# EAGLE design wifi-controller-x4-rev-A (EAGLE 7.3.0)
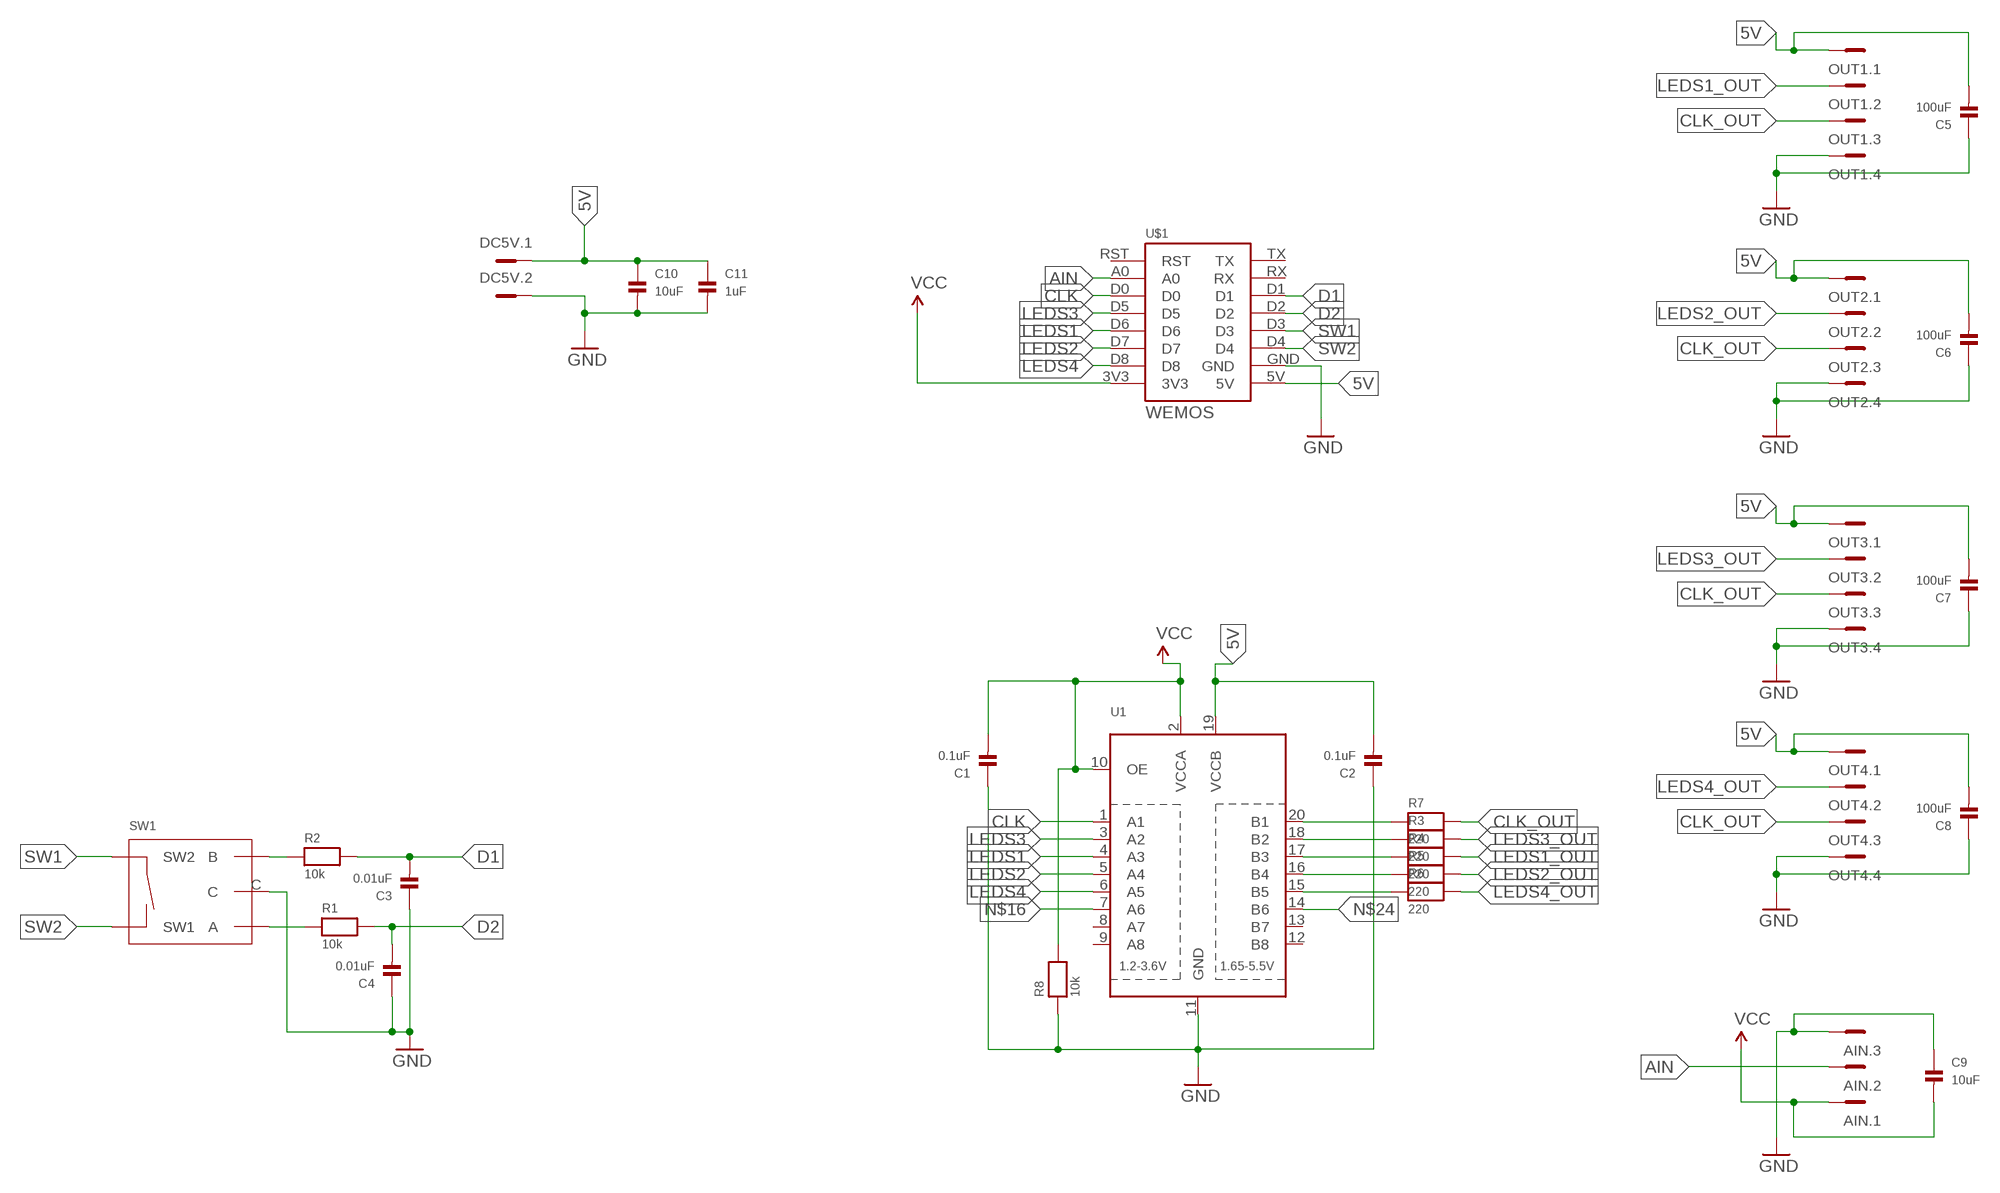
[diagram p0: schematic, sheet 1]

## Parts
AIN  MC3  [MC3]
C1  0.1uF  CAP_CERAMIC0603  [0603]
C2  0.1uF  CAP_CERAMIC0603  [0603]
C3  0.01uF  CAP_CERAMIC0603  [0603]
C4  0.01uF  CAP_CERAMIC0603  [0603]
C5  100uF  CAP_CERAMIC1206  [1206]
C6  100uF  CAP_CERAMIC1206  [1206]
C7  100uF  CAP_CERAMIC1206  [1206]
C8  100uF  CAP_CERAMIC1206  [1206]
C9  10uF  CAP_CERAMIC0603  [0603]
C10  10uF  CAP_CERAMIC0603  [0603]
C11  1uF  CAP_CERAMIC0603  [0603]
DC5V  MC2  [MC2]
OUT1  MC4  [MC4]
OUT2  MC4  [MC4]
OUT3  MC4  [MC4]
OUT4  MC4  [MC4]
R1  10k  RESISTOR0603  [0603]
R2  10k  RESISTOR0603  [0603]
R3  220  RESISTOR0603  [0603]
R4  220  RESISTOR0603  [0603]
R5  220  RESISTOR0603  [0603]
R6  220  RESISTOR0603  [0603]
R7  220  RESISTOR0603  [0603]
R8  10k  RESISTOR0603  [0603]
SW1  ROTARY-ENCODER-BOURNS-PEC11S  [PEC11S]
U1  TXB0108PWR  [TSSOP20]
U$1  WEMOS  [WEMOS]

## Nets
5V: C2.2 C5.2 C6.2 C7.2 C8.2 C10.1 C11.1 DC5V.1 OUT1.1 OUT2.1 OUT3.1 OUT4.1 U1.19(VCCB) U$1.5V
AIN: AIN.2 U$1.A0
CLK: U1.1(A1) U$1.D0
CLK_OUT: OUT1.3 OUT2.3 OUT3.3 OUT4.3 R7.2
D1: C3.2 R2.2 U$1.D1
D2: C4.2 R1.2 U$1.D2
GND: AIN.3 C1.1 C2.1 C3.1 C4.1 C5.1 C6.1 C7.1 C8.1 C9.1 C10.2 C11.2 DC5V.2 OUT1.4 OUT2.4 OUT3.4 OUT4.4 R8.1 SW1.C U1.11(GND) U$1.GND
LEDS1: U1.4(A3) U$1.D6
LEDS1_OUT: OUT1.2 R4.2
LEDS2: U1.5(A4) U$1.D7
LEDS2_OUT: OUT2.2 R5.2
LEDS3: U1.3(A2) U$1.D5
LEDS3_OUT: OUT3.2 R3.2
LEDS4: U1.6(A5) U$1.D8
LEDS4_OUT: OUT4.2 R6.2
N$1: R7.1 U1.20(B1)
N$2: R3.1 U1.18(B2)
N$3: R2.1 SW1.B
N$4: R4.1 U1.17(B3)
N$5: R5.1 U1.16(B4)
N$6: R1.1 SW1.A
N$7: R6.1 U1.15(B5)
N$16: U1.7(A6)
N$24: U1.14(B6)
SW1: SW1.E(SW2) U$1.D3
SW2: SW1.D(SW1) U$1.D4
VCC: AIN.1 C1.2 C9.2 R8.2 U1.2(VCCA) U1.10(OE) U$1.3V3
Unconnected: U1.8(A7) U1.9(A8) U1.12(B8) U1.13(B7) U$1.RST U$1.RX U$1.TX

## Library data of the parts
AIN = con-phoenix-381_l:MC3: Mini-Combicon 3.81mm horizontal 3-polig (ohne Gegenstecker)
C1-C11 = microbuilder:CAP_CERAMIC: Ceramic Capacitors 0402 - 0402 Surface Mount Capacitors 16pF 50V 5% [Digikey: 445-4899-2-ND] 18pF 50V 5% [Digikey: 490-1281-2-ND] 22pF 50V 5% [Digikey: 490-1283-2-ND] 68pF 50V 5% [Digikey: 490-1289-2-ND] 0.1uF 10V 10% [Digikey: 490-1318-2-ND] 1.0uF 6.3V 10% [Digikey: 490-1320-2-ND] 0603 - 0603 Surface Mount Capacitors 16 pF 50V 5% [Digikey: 445-5051-2-ND] 22 pF 50V [Digikey: PCC220ACVTR-ND] 33 pF 50V 5% [Digikey: 490-1415-1-ND] 56pF 50V 5% [Digikey: 490-1421-1-ND] 220pF 50V 5% [Digikey: 445-1285-1-ND] 680 pF 50V 2200 pF 50V 5% C0G [Digikey: 445-1297-1-ND] 5600 pF 100V 5% X7R [Digikey: 478-3711-1-ND] 0.1 µF 25V 10% [Digikey: PCC2277TR-ND] 0.22 µF 16V 10% X7R [Digikey: 445-1318-1-ND] 1.0 µF 25V 10% [Digikey: 445-5146-2-ND] 0603 - RF Specific 3pF 250V +/-0.1pF RF [Digikey: 712-1347-1-ND] 18 pF 250V 5% [Digikey: 478-3505-1-ND or 712-1322-1-ND] 56 pF 250V 5% C0G RF [Digikey: 490-4867-1-ND] 68 pF 250V RF [Digikey: 490-4868-1-ND] 0805 - 0805 Surface Mount Capacitors 220 pF 250V 2% RF Ceramic Capacitor [Digikey: 712-1398-1-ND] 1000 pF 50V 2% NP0 Ceramic Capacitor [Digikey: 478-3760-1-ND] 0.1 µF 25V 10% Ceramic Capacitor [Digikey: PCC1828TR-ND] 1.0 µF 16V 10% Ceramic Capacitor[Digikey: 490-1691-2-ND] 10.0 µF 10V 10% Ceramic Capacitor[Digikey: 709-1228-1-ND] 10.0 uF 16V 10% Ceramic Capacitor [Digikey: 478-5165-2-ND] 47 uF 6.3V 20% Ceramic Capacitor [Digikey: 587-1779-1-ND or 399-5506-1-ND] 1206 - 1206 Surface Mount Capacitors 47uF 10V 20% Ceramic Capacitor [Digikey: 490-5528-1-ND or 399-5508-1-ND or 445-6010-1-ND] 100uF 6.3V -20%, +80% Y5V Ceramic Capacitor (Digikey: 490-4512-1-ND, Mouser: 81-GRM31CF50J107ZE1L)
DC5V = con-phoenix-381_l:MC2: Mini-Combicon 3.81mm horizontal 2-polig (ohne Gegenstecker)
OUT1-OUT4 = con-phoenix-381_l:MC4: Mini-Combicon 3.81mm horizontal 4-polig (ohne Gegenstecker)
R1-R8 = microbuilder:RESISTOR: Resistors 0402 - 0402 Surface Mount Package 22 Ohm 1% 1/16W [Digikey: 311-22.0LRTR-ND] 33 Ohm 5% 1/16W 1.0K 5% 1/16W 1.5K 5% 1/16W 2.0K 1% 1/16W 10.0K 1% 1/16W [Digikey: 311-10.0KLRTR-ND] 10.0K 5% 1/16W [Digikey: RMCF0402JT10K0TR-ND] 12.1K 1% 1/16W [Digikey: 311-22.0LRTR-ND] 100.0K 5% 1/16W 0603 - 0603 Surface Mount Package 0 Ohm 1/10 Watt 1% Resistor 15 Ohm 1/10 Watt 1% Resistor 33 Ohm 1/10 Watt 1% Resistor 49.9 Ohm 1/10 Watt 1% Resistor 100 Ohm 1/10 Watt 1% Resistor 150 Ohm 1/10 Watt 1% Resistor 240 Ohm 1/10 Watt 1% Resistor 390 Ohm 1/10 Watt 1% Resistor 560 Ohm 1/10 Watt 1% Resistor 680 Ohm 1/10 Watt 1% Resistor 750 Ohm 1/10 Watt 1% Resistor 1.0K Ohm 1/10 Watt 1% Resistor 1.5K Ohm 1/10 Watt 1% Resistor 2.0K Ohm 1/10 Watt 1% Resistor 2.2K Ohm 1/10 Watt 1% Resistor 3.3K Ohm 1/10 Watt 1% Resistor 4.7K Ohm 1/10 Watt 1% Resistor 10.0K Ohm 1/10 Watt 1% Resistor 12.0K Ohm 1/10 Watt 1% Resistor 12.1K Ohm 1/10 Watt 1% Resistor 20.0K Ohm 1/10 Watt 1% Resistor 33.0K Ohm 1/10 Watt 1% Resistor 100.0K Ohm 1/10 Watt 1% Resistor 0805 - 0805 Surface Mount Package 0 Ohm 1/8 Watt 1% Resistor 33 Ohm 1/8 Watt 1% Resistor 100 Ohm 1/8 Watt 1% Resistor 150 Ohm 1/8 Watt 1% Resistor 200 Ohm 1/8 Watt 1% Resistor 240 Ohm 1/8 Watt 1% Resistor 330 Ohm 1/8 Watt 1% Resistor 390 Ohm 1/8 Watt 1% Resistor 470 Ohm 1/8 Watt 1% Resistor 1.0K Ohm 1/8 Watt 1% Resistor 1.5K Ohm 1/8 Watt 1% Resistor 2.0K Ohm 1/8 Watt 1% Resistor 4.7K Ohm 1/8 Watt 1% Resistor 5.1K Ohm 1/8 Watt 1% Resistor 5.6K Ohm 1/8 Watt 1% Resistor 10.0K Ohm 1/8 Watt 1% Resistor 22.0K Ohm 1/8 Watt 1% Resistor 33.0K Ohm 1/8 Watt 1% Resistor 100K Ohm 1/8 Watt 1% Resistor 1206 - 1206 Surface Mount Package 2012 - 2010 Surface Mount Package 0.11 Ohm 1/2 Watt 1% Resistor - Digikey: RHM.11UCT-ND
SW1 = Custom:ROTARY-ENCODER-BOURNS
U1 = microbuilder:TXB0108PWR: 8-Bit Bi-Directional Level Shifter 1.2V-3.6V (VCCA) to 1.65V-5.5V (VCCB) bi-directional level shifter with auto direction sensing. Max data rate - VCCA 1.8V: 20Mbps (50ns), VCCA 3.3V: 100Mbps (10ns) Digikey: 296-21527-1-ND
U$1 = 1455413453956-wemos:WEMOS

## Board
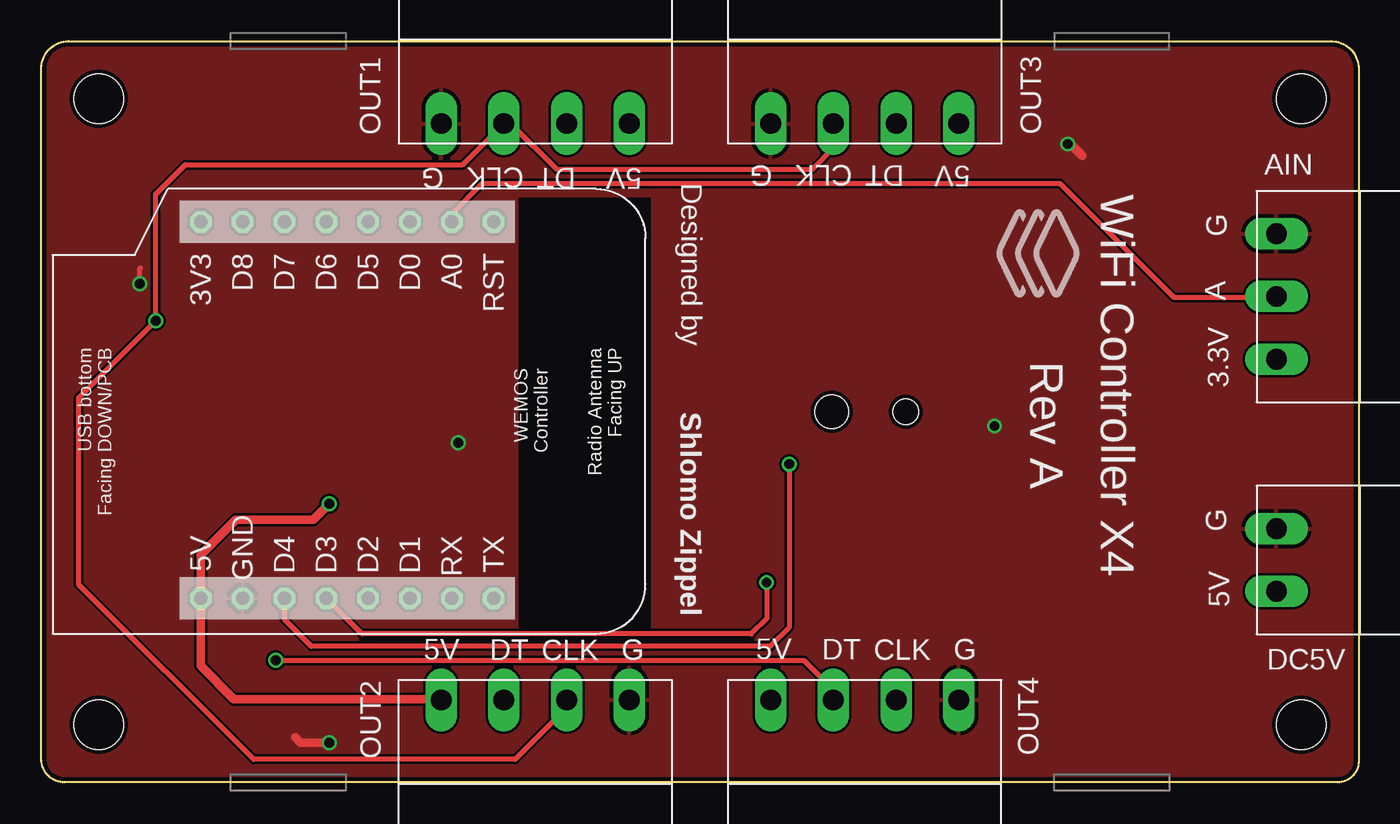
[diagram p1: board, top side]
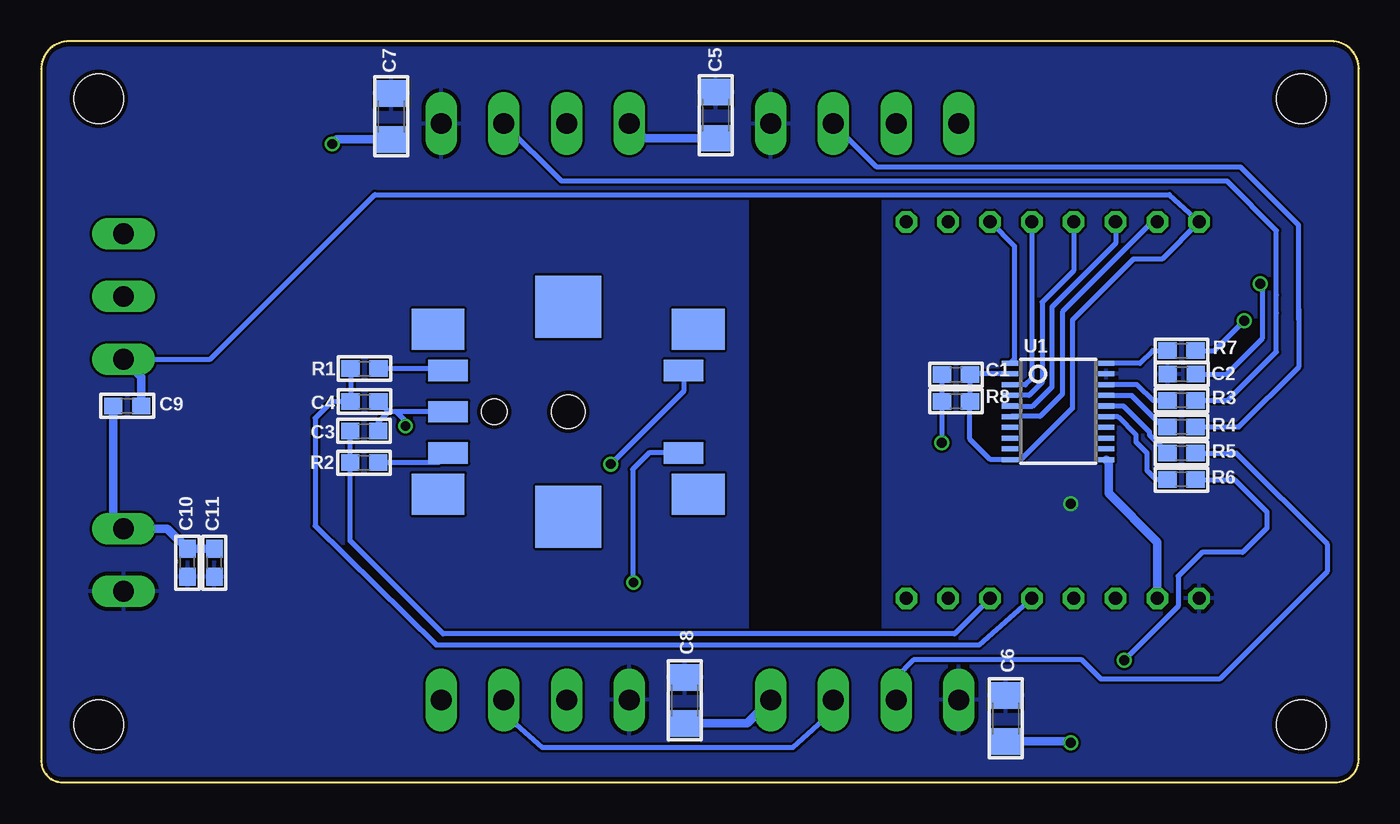
[diagram p2: board, bottom side, seen from below]

Size 80 x 45 mm. Coordinates in mm from the lower left corner, seen from the top.
Copper layers (1*16): Top 0.035mm / dielectric 1.5mm / Bottom 0.035mm
Design rules "SeeedStudio_2layer_DRU_no_angle_20140221": minimum track width 6mil, minimum drill 12mil, track to track 6mil, track to pad 6mil, pad to pad 6mil, via to via 6mil, smd to smd 0mil, copper to edge 10mil, drill to drill 10mil, minimum pad ring 10mil, minimum via ring 6mil, stop-mask expansion 2mil, vias tented up to drill 100mil, thermal gap 10mil
tRestrict: area 29,9.5 to 37,35.5
bRestrict: area 29,9.5 to 37,35.5

### Footprints (pad centres in the part's own frame; a part is rotated, then mirrored left to right if it is on the bottom)
MC3 = drill 1.27 long: 1 -3.81,0; 2 0,0; 3 3.81,0
0603 = smd 1.1 x 1: 1 -0.85,0; 2 0.85,0
1206 = smd 1.6 x 1.8: 1 -1.4,0; 2 1.4,0
MC2 = drill 1.27 long: 1 -1.905,0; 2 1.905,0
MC4 = drill 1.27 long: 1 -5.715,0; 2 -1.905,0; 3 1.905,0; 4 5.715,0
PEC11S = smd 1.3 x 2.4: A -2.5,-7.3; B 2.5,-7.3; C 0,-7.3; D -2.5,7; E 2.5,7 | smd 3.75 x 4: P$6 -6.375,0; P$7 6.375,0 | smd 2.5 x 3.2: P$8 -5,7.9; P$9 5,7.9; P$10 -5,-7.9; P$11 5,-7.9 | hole 2.05: 0,0 | hole 1.55: 0,-4.5
TSSOP20 = smd 0.305 x 0.991: 1 -2.925,-2.918; 2 -2.275,-2.918; 3 -1.625,-2.918; 4 -0.975,-2.918; 5 -0.325,-2.918; 6 0.325,-2.918; 7 0.975,-2.918; 8 1.625,-2.918; 9 2.275,-2.918; 10 2.925,-2.918; 11 2.925,2.918; 12 2.275,2.918; 13 1.625,2.918; 14 0.975,2.918; 15 0.325,2.918; 16 -0.325,2.918; 17 -0.975,2.918; 18 -1.625,2.918; 19 -2.275,2.918; 20 -2.925,2.918
WEMOS = drill 0.8 octagon: 3V3 0,0; 5V 22.86,0; A0 0,15.24; D0 0,12.7; D1 22.86,12.7; D2 22.86,10.16; D3 22.86,7.62; D4 22.86,5.08; D5 0,10.16; D6 0,7.62; D7 0,5.08; D8 0,2.54; GND 22.86,2.54; RST 0,17.78; RX 22.86,15.24; TX 22.86,17.78
86*51 = hole 3: -36.5,19; 36.5,19; 36.5,-19; -36.5,-19

### Placement (x,y rotation side)
AIN  75,29.5 90 top
C1  24.46,24.75 0 bottom
C2  10.76,24.78 180 bottom
C3  60.39,21.34 180 bottom
C4  60.37,23.12 180 bottom
C5  39.03,40.51 90 bottom
C6  21.43,3.88 90 bottom
C7  58.75,40.43 90 bottom
C8  40.91,4.97 90 bottom
C9  74.77,22.86 0 bottom
C10  71.11,13.33 90 bottom
C11  69.49,13.33 90 bottom
DC5V  75,13.5 90 top
OUT1  30,40 180 top
OUT2  30,5 0 top
OUT3  50,40 180 top
OUT4  50,5 0 top
R1  60.37,25.13 180 bottom
R2  60.39,19.41 180 bottom
R3  10.76,23.19 0 bottom
R4  10.76,21.59 0 bottom
R5  10.76,19.99 0 bottom
R6  10.76,18.39 0 bottom
R7  10.76,26.21 0 bottom
R8  24.46,23.14 0 bottom
SW1  48,22.5 270 bottom
U1  18.26,22.53 270 bottom
U$1  9.69,34.03 270 top
U$8  [86*51]  40,22.5 0 top

### Tracks (layer width: path | path; a pad name or v marks a point on that pad's centre or on a via)
5V  (via drill 0.6)
  Top 0.508: OUT2.1 24.23,5.05 11.7,5.05 9.69,7.06 U$1.5V 9.69,13.83 11.81,15.95 16.53,15.95 v17.5,16.91
  pour Bottom: 0,45.5 80,45.5 80,-0.5 0,-0.5
AIN
  Top 0.305: U$1.A0 24.93,34.51 26.79,36.37 61.84,36.37 68.75,29.46 74.96,29.46 AIN.2
CLK
  Bottom 0.305: U$1.D0 20.92,32.56 20.92,25.64 20.98,25.64 U1.1
CLK_OUT  (via drill 0.6)
  Top 0.305: OUT3.3 48.18,39.92 48.18,38.58 46.83,37.23 31.29,37.23 28.52,40 OUT1.3 25.61,37.51 8.76,37.51 6.95,35.71 v6.95,28.04 2.28,23.36 2.28,12.01 12.9,1.39 28.77,1.39 31.91,4.52 OUT2.3
  Bottom 0.305: R7.2 8.78,26.21 v6.95,28.04 | OUT2.3 31.91,4.33 34.36,2.1 49.58,2.1 51.94,4.19 51.94,4.97 OUT4.3
D1
  Bottom 0.305: U$1.D1 24.55,9.01 55.6,9.01 61.24,14.66 R2.2 C3.2
D2
  Bottom 0.305: R1.2 C4.2 62.36,23.12 63.37,22.12 63.37,15.57 56.03,8.35 23.05,8.35 U$1.D2
GND  (via drill 0.6)
  Top 0.305: v5.99,30.27 5.99,31.19 6.04,31.24
  Top 0.508: v17.5,2.41 15.74,2.41 15.41,2.74 | v62.33,38.76 62.5,38.76 63.22,38.05
  Bottom 0.305: 59.52,21.36 C3.1 59.54,21.85 58.89,22.5 | C2.1 8.03,24.78 5.84,26.97 5.84,30.12 v5.99,30.27 | SW1.C 58.44,22.5 | 58.44,22.5 58.89,22.5 | 58.89,22.5 C4.1 | v57.88,21.64 57.88,21.94 58.44,22.5 | C1.1 R8.1 | R8.1 | R8.1 25.31,20.63 v25.32,20.62 | 15.29,19.55 U1.11
  Bottom 0.508: U$1.GND 12.23,14.59 15.18,17.55 15.18,19.45 U1.11 | C6.1 17.57,2.48 v17.5,2.41 | C8.1 37.14,3.57 OUT2.4 | C7.1 62.05,39.03 v62.33,38.76 | C9.1 75.62,16.03 DC5V.2 72.34,15.41 C10.2 C11.2 | C5.1 43.39,39.11 OUT3.4
  pour Top: 0,45.5 80,45.5 80,-0.5 0,-0.5
LEDS1
  Bottom 0.305: U$1.D6 17.31,31.07 19.22,29.16 19.22,24.28 20.01,23.49 21.12,23.49 21.13,23.5 U1.4
LEDS1_OUT
  Bottom 0.305: 3.65,28.09 3.65,28.72 | 3.65,28.72 3.65,33.83 7.18,37.36 29.26,37.36 OUT1.2 | R4.2 7.28,21.59 3.63,25.24 3.63,28.7 3.65,28.72
LEDS2
  Bottom 0.305: U$1.D7 14.77,32.72 18.64,28.85 18.64,24 19.83,22.8 21.13,22.8 U1.5
LEDS2_OUT
  Bottom 0.305: R5.2 7.44,19.98 1.92,14.47 1.92,12.8 8.45,6.27 15.64,6.27 16.81,7.44 27.05,7.44 28.09,6.39 OUT2.2
LEDS3
  Bottom 0.305: U$1.D5 19.85,24.51 20.24,24.13 21.15,24.13 U1.3
LEDS3_OUT
  Bottom 0.305: 5,28.5 5,29.59 | 5,29.59 5,33.5 8,36.5 48.41,36.5 OUT3.2 | R3.2 7.95,23.19 5,26.13 5,29.59
LEDS4
  Bottom 0.305: U$1.D8 12.54,34.03 18,28.57 18,23.57 19.35,22.22 21.09,22.22 21.11,22.2 U1.6
LEDS4_OUT  (via drill 0.6)
  Top 0.305: v14.24,7.41 46.3,7.41 48,5.71 48,5.09 OUT4.2
  Bottom 0.305: R6.2 7.54,18.38 5.58,16.43 5.58,15.44 7.06,13.97 9.52,13.97 10.97,12.52 10.97,10.69 v14.24,7.41
N$1
  Bottom 0.305: R7.1 12.52,26.21 13.29,25.43 15.32,25.43 U1.20
N$2
  Bottom 0.305: 11.75,23.32 arc90 R3.1 12.49,23.19 13.44,24.14 15.32,24.14 U1.18
N$3
  Bottom 0.305: SW1.B 55.89,19.41 R2.1
N$4
  Bottom 0.305: 11.84,21.81 R4.1 11.87,21.84 12.16,21.84 13.78,23.46 13.78,23.48 15.32,23.48 U1.17
N$5
  Bottom 0.305: 11.64,19.96 R5.1 12.72,21.09 12.72,21.28 14.27,22.84 15.32,22.84 U1.16
N$6
  Bottom 0.305: SW1.A 55.43,25.13 R1.1
N$7
  Bottom 0.305: R6.1 11.64,18.41 12.34,18.41 12.87,18.94 12.87,20.01 13.53,20.67 13.53,21.1 14.62,22.18 15.32,22.18 U1.15
SW1  (via drill 0.6)
  Top 0.305: U$1.D3 19.47,9.01 43.12,9.01 44.04,9.93 v44.04,12.14
  Bottom 0.305: SW1.E 43.08,20 44.09,19 44.09,12.19 v44.04,12.14
SW2  (via drill 0.6)
  Top 0.305: v45.41,19.32 45.41,9.39 44.27,8.25 16.4,8.25 14.78,9.88 U$1.D4
  Bottom 0.305: SW1.D 41,23.73 v45.41,19.32
VCC
  Bottom 0.305: 23.58,24.79 C1.2 | AIN.1 69.73,25.69 59.74,35.68 11.5,35.68 U$1.3V3 11.95,31.77 13.69,31.77 17.39,28.06 17.39,22.7 20.52,19.58 21.15,19.58 U1.10 22.37,19.6 23.61,20.84 R8.2 C1.2 | U1.2 23.56,24.8 C1.2
  Bottom 0.508: C9.2 73.92,24.61 AIN.1

### Text on the board
tPlace: G | CLK | DT | 5V | G | CLK | DT | 5V | Designed by | WiFi Controller X4 | G | A | Rev A | 3.3V | Shlomo Zippel | G | 5V | 5V | DT | CLK | G | 5V | DT | CLK | G